# Altium schematic sheet 5V_REG.SchDoc
size A4; SheetNumber: 12; SheetTotal: 19
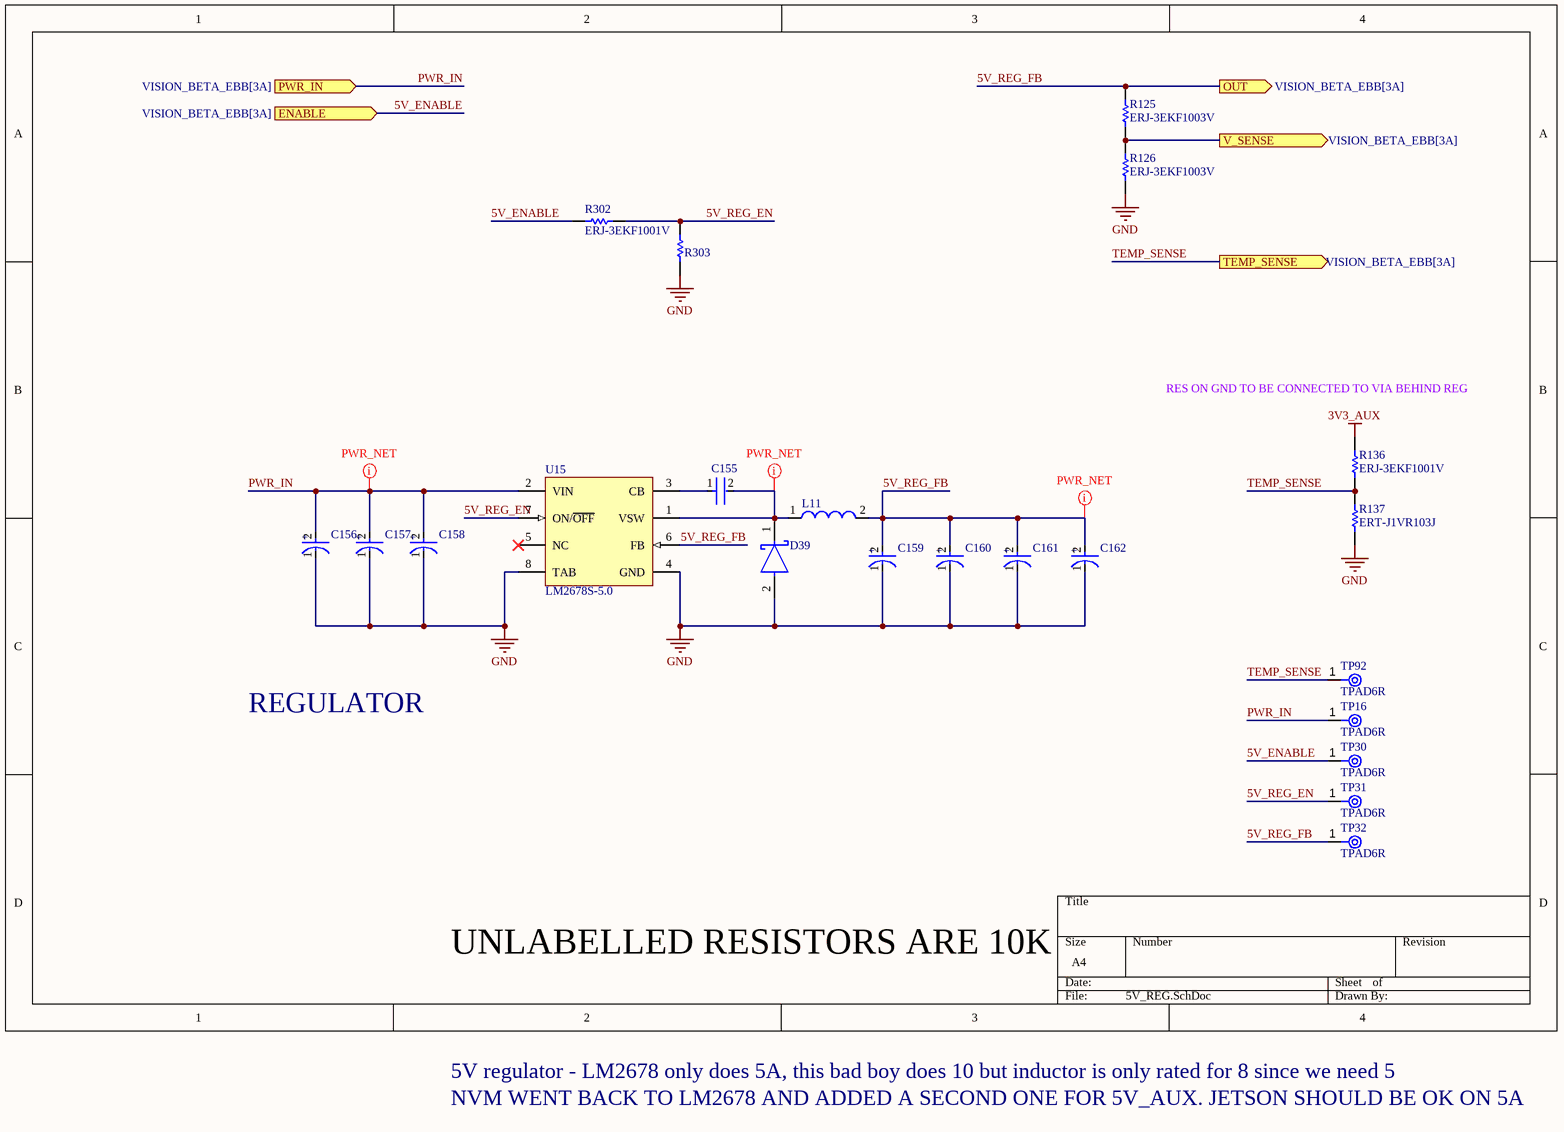
[diagram p0: 5V_REG.SchDoc]

## Parts
C155  C0805C103J5RACTU  [FP-C0805C-DN-MFG]  (value not drawn)
C156  20SVP33M  [FP-OS-CON-SMT-E7-MFG]  (value not drawn)
C157  20SVP33M  [FP-OS-CON-SMT-E7-MFG]  (value not drawn)
C158  20SVP33M  [FP-OS-CON-SMT-E7-MFG]  (value not drawn)
C159  EEE-1AA101WR  [FP-SC-MFG]  (value not drawn)
C160  EEE-1AA101WR  [FP-SC-MFG]  (value not drawn)
C161  EEE-1AA101WR  [FP-SC-MFG]  (value not drawn)
C162  EEE-1AA101WR  [FP-SC-MFG]  (value not drawn)
D39  B540C-13-F  [FP-SMC-MFG]  (value not drawn)
L11  74477110  [WE-PD-L]  (value not drawn)
R125  ERJ-3EKF1003V  [RESC1608X55X30ML15T15]
R126  ERJ-3EKF1003V  [RESC1608X55X30ML15T15]
R136  ERJ-3EKF1001V  [RESC1608X55X30LL15T15]
R137  ERT-J1VR103J  [RESC1608X90X30ML15T20]
R302  ERJ-3EKF1001V  [RESC1608X55X30LL15T15]
R303  ERJ3EKF1002V  [RESC1609X55X30LL15T15]  (value not drawn)
TP16  TPAD6R  [New footprint 1]
TP30  TPAD6R  [New footprint 1]
TP31  TPAD6R  [New footprint 1]
TP32  TPAD6R  [New footprint 1]
TP92  TPAD6R  [New footprint 1]
U15  LM2678S-5.0  [KTW0007B_N]

## Ports
ENABLE (in, see VISION_BETA_EBB[3A]), OUT (out, see VISION_BETA_EBB[3A]), PWR_IN (in, see VISION_BETA_EBB[3A]), TEMP_SENSE (out, see VISION_BETA_EBB[3A]), V_SENSE (out, see VISION_BETA_EBB[3A])

## Nets
3V3_AUX: R136.2
GND: C156.1(C) C157.1(C) C158.1(C) C159.1(C) C160.1(C) C161.1(C) C162.1(C) D39.2(A) R126.1 R137.1 R303.1 U15.4(GND) U15.8(TAB)
5V_ENABLE: R302.1 TP30.1(TP) ; port ENABLE
5V_REG_EN: R302.2 R303.2 TP31.1(TP) U15.7(ON/~{OFF})
5V_REG_FB: C159.2(A) C160.2(A) C161.2(A) C162.2(A) L11.2 R125.2 TP32.1(TP) U15.6(FB) ; port OUT
PWR_IN: C156.2(A) C157.2(A) C158.2(A) TP16.1(TP) U15.2(VIN) ; port PWR_IN
TEMP_SENSE: R136.1 R137.2 TP92.1(TP) ; port TEMP_SENSE
V_SENSE: R125.1 R126.2 ; port V_SENSE
NetC155_1: C155.1 U15.3(CB)
NetC155_2: C155.2 D39.1(C) L11.1 U15.1(VSW)

Not connected (* = marked no-connect by the designer): U15 5(NC)*

## Layout directives
net class PWR: 5V_REG_FB, NetC155_2, PWR_IN

## Notes on the sheet
- RES ON GND TO BE CONNECTED TO VIA BEHIND REG
- REGULATOR
- UNLABELLED RESISTORS ARE 10K
- 5V regulator - LM2678 only does 5A, this bad boy does 10 but inductor is only rated for 8 since we need 5
- NVM WENT BACK TO LM2678 AND ADDED A SECOND ONE FOR 5V_AUX. JETSON SHOULD BE OK ON 5A
- (in symbol CMP-05427-000047-1) +
- (in symbol CMP-05428-001387-1) +

## Library data of the parts
C155 = CMP-2007-00254-2: CAP CER 10000PF 50V X7R 0805; Manufacturer: KEMET; Value: 10,000 pF; Material: Ceramic; Temperature Coefficient: 30ppm/°C; Tolerance: 0.05; Device Class L1: Passive Components; Temperature: -55°C to +125°C; Lead Free: Yes; ComponentLink2URL: https://content.kemet.com/datasheets/KEM_C1003_C0G_SMD.pdf; Device Class L3: Ceramic Capacitors; Temperature Characteristic: X7R; Temperature Range High: +125°C; Mouser Description: Capacitor; Ceramic; Cap 0.01uF; Tol 5%; Vol-Rtg 50 V; SMT; Case 0805; X7R; TR; ComponentLink2Description: Datasheet; Manufacturer Part Number: C0805C103J5RACTU; Height: 0.88mm; Digikey Description: CAP CER 10000PF 50V X7R 0805; Capacitance: 10,000 pF; Temperature Range Low: -55°C; Device Class L2: Capacitors; Octopart: https://octopart.com/c0805c103j5ractu-kemet-133473; Voltage Rating: 50 V; Category: Cap; RoHS: TRUE; Automotive: No; Package: C0805C-DN; Ipc Land Pattern Name: CAPC200125X78
C156-C158 = CMP-05428-001387-1: Conductive Polymer Aluminum Solid Capacitors (OS-CON) 33uF ±20% 20V RADIAL SMT 8x6.9mm; Polarity: Polar; Life (Hours): 2000Hour; Leakage Current: 132uA; ESR (Equivalent Series Resistance): 45mR; Ripple Current (AC): 1.89A; Dissipation Factor: 12%; Construction: Cylindrical; Capacitance: 33uF; Max Operating Temperature: 105°C; Min Operating Temperature: -55°C; Voltage: 20V; Number of Pins: 7; Termination: SMD/SMT; Package Quantity: 1000; Packaging: Tape and Reel; REACH SVHC: No SVHC; Mount: Surface Mount; Tolerance: 20%; Voltage Rating (DC): 20V; Height: 6.9mm; Series: OS-CON™, SVP; Diameter: 8mm; Length: 6.9mm; Ripple Current: 1.89A; RoHS Compliant: Yes; Height - Seated (Max): 0.276inch; Case/Package: Radial; Voltage Rating: 20V
C159-C162 = CMP-05427-000047-1: CAP ALUM 100UF 20% 10V SMD; Life (Hours): 1000Hour; Ripple Current: 50mA; Packaging: Tape and Reel; Diameter: 5mm; Voltage Rating (DC): 10V; Mount: Surface Mount; Max Operating Temperature: 85°C; Length: 5.5mm; Case/Package: Radial; Height: 5.4mm; Construction: Cylindrical; Termination: SMD/SMT; Height - Seated (Max): 0.213inch; Series: S; Min Operating Temperature: -40°C; Capacitance: 100uF; Tolerance: 20%; Voltage Rating: 10V; Package Quantity: 1; Radiation Hardening: No; Ripple Current (AC): 50mA; Lead Free: Lead Free; RoHS Compliant: Yes; Contact Plating: Tin
D39 = CMP-2000-05097-3: DIODE SCHOTTKY 40V 5A SMC; Manufacturer: Diodes Inc.; Automotive Grade: NA; Peak Reverse Current: 0.5mA; Value: 300pF; Max Junction Temp: +150°C; Max Surge Forward Current: 100A; Standoff Height: 0.1mm; Digikey Description: DIODE SCHOTTKY 40V 5A SMC; Temperature Range Low: -55°C; Manufacturer Part Number: B540C-13-F; Octopart: https://octopart.com/b540c-13-f-diodes+inc.-325873; Lead Free: Yes; Reverse Voltage: 40V; RoHS: TRUE; Category: Diode; Mouser Description: Diode: Schottky rectifying; SMD; 40V; 5A; SMC; Package: reel, tape; ComponentLink2Description: Datasheet; Temperature Range High: +150°C; Automotive: No; Footprint Url: https://www.diodes.com/assets/Package-Files/SMC.pdf; Device Class L3: Schottky Diodes; Height: 2.5mm; Forward Current: 5A; Temperature: -55°C to +150°C; Package: SMC; ComponentLink2URL: https://www.diodes.com/assets/Datasheets/ds13012.pdf; Device Class L2: Diodes; Max Repetitive Reverse Voltage: 40V; Device Class L1: Discrete Semiconductors; Capacitance: 300pF
L11 = CMP-0227-00708-1: SMD-Shielded Power Inductor WE-PD, L = 10.0 µH; Inductance: 10.0 ÂµH; ComponentLink2Description: Datasheet; DatasheetVersion: ver 7, Sep-2006; PackageVersion: 2006; ComponentLink1URL: http://www.we-online.com; ComponentLink1Description: Manufacturer Link; ComponentLink2URL: http://www.we-online.de/katalog/media/pdf/74477110.pdf; PackageDescription: SMD Inductor, 2-Leads, Body 12.0 x 12.0 mm; PackageReference: WE-PD-L
R125 R126 = CMP-2000-00182-1: Manufacturer: Panasonic; Part Number: ERJ-3EKF1003V
R136 R302 = CMP-2000-00180-1: Manufacturer: Panasonic; Part Number: ERJ-3EKF1001V
R137 = CMP-2000-00869-1: Manufacturer: Panasonic; Part Number: ERT-J1VR103J
R303 = CMP-1012-00623-3: Chip Resistor, 10 KOhm, +/- 1%, 0.1 W, -55 to 155 degC, 0603 (1608 Metric), RoHS, Tape and Reel; Manufacturer: Panasonic; Voltage Rating: 75V; Case\/Package: 0603; Power Rating: 100mW; Resistance: 10KOhm; Temperature Coefficient: 100ppm\/degreesC; Number of Pins: 2; Package Reference: 603; Depth: 0.8mm; Mount: SurfaceMount; Package Description: 2-Pin Surface Mount Device, Body 1.6 x 0.85 mm; Datasheet Version: 02/2017; Length: 1.6mm; Lead Free: LeadFree; Height: 0.45mm; Number of Terminations: 2; Max Power Dissipation: 100mW; Min Operating Temperature: -55degC; Datasheet URL: https://industrial.panasonic.com/cdbs/www-data/pdf/RDA0000/AOA0000C304.pdf; Termination: SMD/SMT; Case Code (Metric): 1608; Case Code (Imperial): 0603; Tolerance: 1%; Max Operating Temperature: 155degC; RoHSCompliant: true; Voltage Rating (DC): 75V; Radiation Hardening: No; Packaging: TapeandReel; Composition: ThickFilm; Mounting Technology: SurfaceMount; Manufacturer URL: http://www.panasonic.com/; Width: 0.031inch; REACH SVHC: NoSVHC; Contact Plating: Tin; Military Standard: Not; Package Quantity: 1
TP16 TP30-TP32 TP92 = CMP-00025-2: Test Point .6mm
U15 = CMP-0069-00190-3: SIMPLE SWITCHER® High Efficiency 5A Step-Down Voltage Regulator, 7-pin TO-263; Manufacturer: Texas Instruments; PowerWise: N; PackageTopMarking: NSUZXYTTE#*LM2678*S-5.0; RoHS: N; PinCount: 7; Code_JEDEC: MO-169-AC; ComponentLink1URL: http://www.ti.com/general/docs/lit/getliterature.tsp?genericPartNumber=LM2678&fileType=pdf; ComponentLink1Description: Datasheet URL; PackageReference: KTW0007B; PackageDescription: TO-263, Molded, .400 x .390 x .180in Body, 7 Lead, .050in Pitch, Surface Mount; CompType: Switcher